# EAGLE design TinyISD1700_V2_2014-08-29sop (EAGLE 7.5.0)
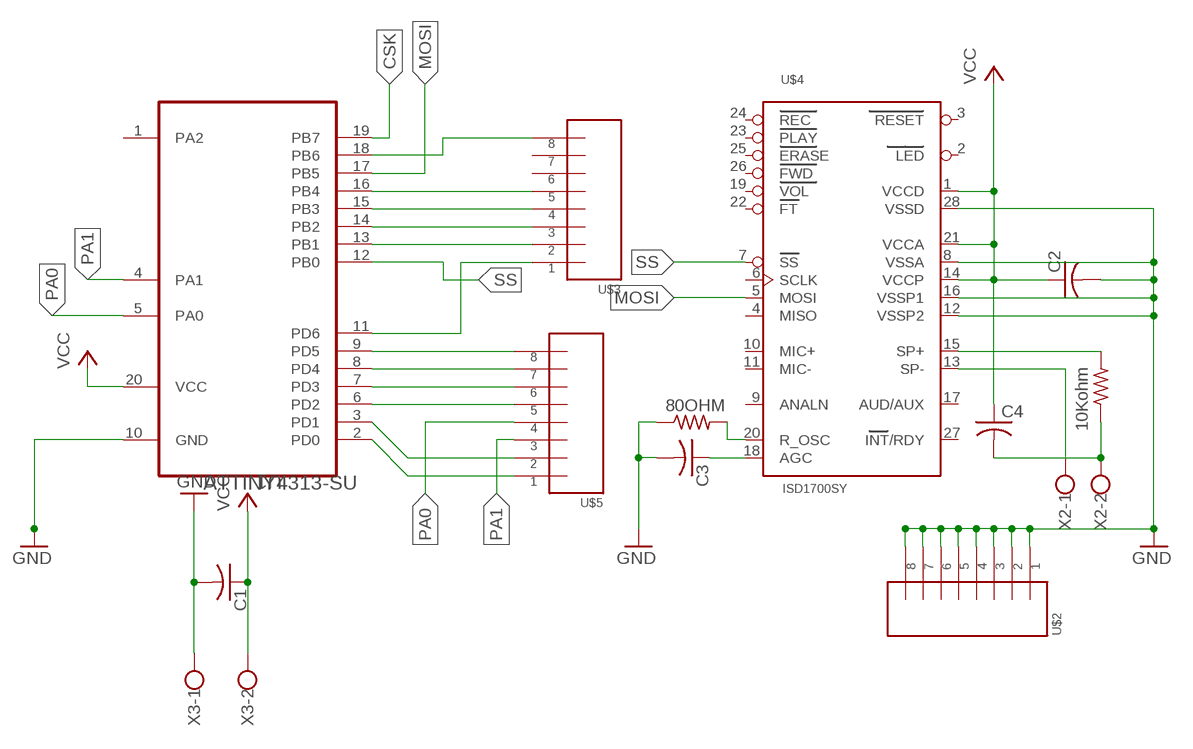
[diagram p0: schematic, sheet 1]

## Parts
80OHM  R-US_0204/2V  [0204V]
80OHM1  10Kohm  R-US_0204/2V  [0204V]
C1  C-US050-030X075  [C050-030X075]
C2  C-US050-030X075  [C050-030X075]
C3  C-US050-030X075  [C050-030X075]
C4  C-US050-030X075  [C050-030X075]
U1  ATTINY4313-SU  [SOIC127P1032X265-20N]
U$2  8PIN_HEADER  [8PIN_HEADER]
U$3  8PIN_HEADER  [8PIN_HEADER]
U$4  ISD1700SY  [SO28W]
U$5  8PIN_HEADER  [8PIN_HEADER]
X2  W237-102  [W237-102]
X3  W237-102  [W237-102]

## Nets
CSK: U1.19(PB7)
GND: 80OHM.1 C1.2 C2.2 C3.2 U1.10(GND) U$2.P$1 U$2.P$2 U$2.P$3 U$2.P$4 U$2.P$5 U$2.P$6 U$2.P$7 U$2.P$8 U$4.8(VSSA) U$4.12(VSSP2) U$4.16(VSSP1) U$4.28(VSSD) X3.1
MOSI: U1.17(PB5) U$4.5(MOSI)
N$1: 80OHM.2 U$4.20(R_OSC)
N$2: U1.13(PB1) U$3.P$2
N$3: U1.14(PB2) U$3.P$3
N$4: 80OHM1.1 C4.2 X2.2
N$5: C3.1 U$4.18(AGC)
N$6: U$4.13(SP-) X2.1
N$7: 80OHM1.2 U$4.15(SP+)
N$8: U1.15(PB3) U$3.P$4
N$9: U1.11(PD6) U$3.P$1
N$11: U1.9(PD5) U$5.P$8
N$12: U1.8(PD4) U$5.P$7
N$13: U1.7(PD3) U$5.P$6
N$14: U1.6(PD2) U$5.P$5
N$15: U1.3(PD1) U$5.P$2
N$16: U1.2(PD0) U$5.P$1
N$20: U1.16(PB4) U$3.P$5
PA0: U1.5(PA0) U$5.P$4
PA1: U1.4(PA1) U$5.P$3
Q: U1.18(PB6) U$3.P$8
SS: U1.12(PB0) U$4.7(SS)
VCC: C1.1 C2.1 C4.1 U1.20(VCC) U$4.1(VCCD) U$4.14(VCCP) U$4.21(VCCA) X3.2
Unconnected: U1.1(PA2) U$3.P$6 U$3.P$7 U$4.2(LED) U$4.3(RESET) U$4.4(MISO) U$4.6(SCLK) U$4.9(ANALN) U$4.10(MIC+) U$4.11(MIC-) U$4.17(AUD/AUX) U$4.19(VOL) U$4.22(FT) U$4.23(PLAY) U$4.24(REC) U$4.25(ERASE) U$4.26(FWD) U$4.27(INT/RDY)

## Library data of the parts
80OHM 80OHM1 = rcl:R-US_: RESISTOR, American symbol; OC_FARNELL: unknown
C1-C4 = resistor:C-US: CAPACITOR, American symbol; OC_FARNELL: unknown
U1 = Atmel_By_element14_Batch_1-00:ATTINY4313-SU: 8-bit Microcontroller with In-System Programmable Flash; MF: MICROCHIP; MPN: ATTINY4313-SU; OC_FARNELL: 1841621; OC_NEWARK: 12T1340; PACKAGE: SOIC-20; SUPPLIER: Atmel
U$2 U$3 U$5 = arduino:8PIN_HEADER; MF: RENESAS; MPN: YSDKS128E10; OC_FARNELL: 2946736
U$4 = isd-new-1:ISD1700; OC_FARNELL: unknown
X2 X3 = con-wago-500:W237-102: WAGO SCREW CLAMP; OC_FARNELL: unknown; OC_NEWARK: 70K9898

## Board
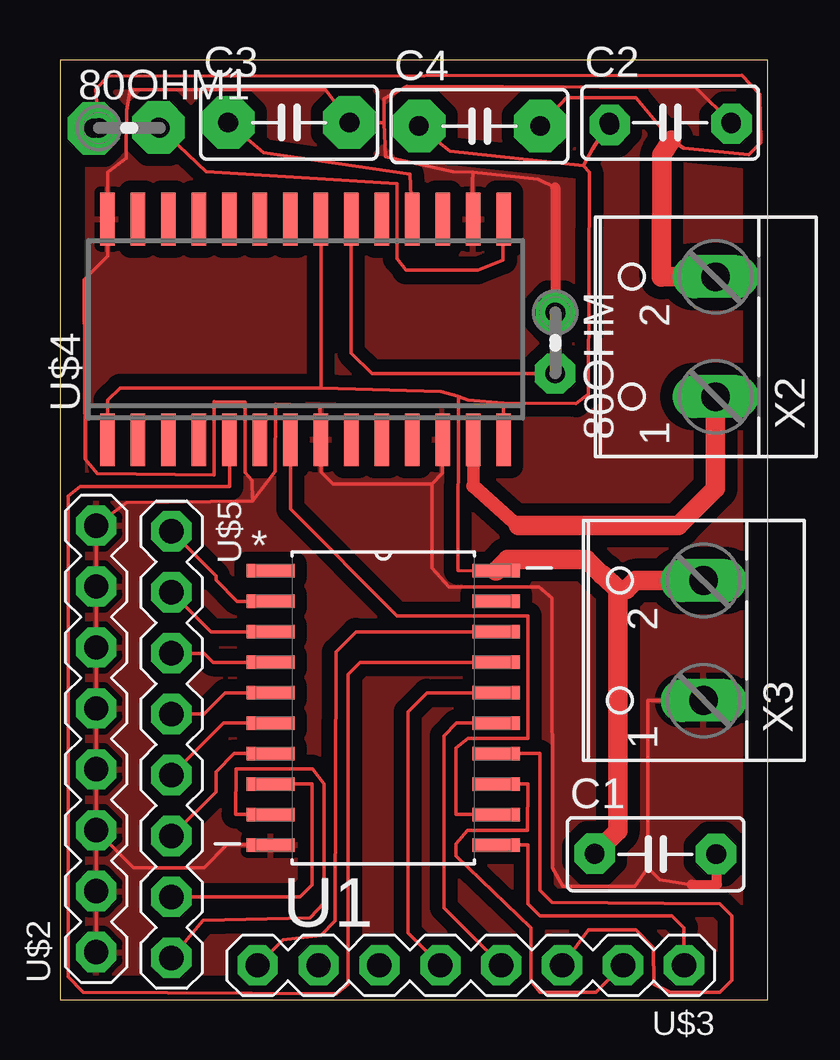
[diagram p1: board, top side]

Size 29.5 x 39.17 mm. Coordinates in mm from the lower left corner, seen from the top.
Outline: 0,0 29.5,0 29.5,39.17 0,39.17 0,0
Copper layers (1*16): Top 0.035mm / dielectric 1.5mm / Bottom 0.035mm
Design rules "default *": minimum track width 10mil, minimum drill 24mil, track to track 20mil, track to pad 20mil, pad to pad 20mil, via to via 20mil, smd to smd 8mil, copper to edge 40mil, drill to drill 8mil, minimum pad ring 10mil, minimum via ring 8mil, stop-mask expansion 4mil, vias tented up to drill 0mil, thermal gap 10mil

### Footprints (pad centres in the part's own frame; a part is rotated, then mirrored left to right if it is on the bottom)
0204V = drill 0.813 octagon: 1 -1.27,0; 2 1.27,0
C050-030X075 = drill 0.813 octagon: 1 -2.54,0; 2 2.54,0
SOIC127P1032X265-20N = smd 1.981 x 0.559: 1 -4.699,5.715; 2 -4.699,4.445; 3 -4.699,3.175; 4 -4.699,1.905; 5 -4.699,0.635; 6 -4.699,-0.635; 7 -4.699,-1.905; 8 -4.699,-3.175; 9 -4.699,-4.445; 10 -4.699,-5.715; 11 4.699,-5.715; 12 4.699,-4.445; 13 4.699,-3.175; 14 4.699,-1.905; 15 4.699,-0.635; 16 4.699,0.635; 17 4.699,1.905; 18 4.699,3.175; 19 4.699,4.445; 20 4.699,5.715
8PIN_HEADER = drill 1.016 pad 1.676 octagon: P$1 0,0; P$2 2.54,0; P$3 5.08,0; P$4 7.62,0; P$5 10.16,0; P$6 12.7,0; P$7 15.24,0; P$8 17.78,0
SO28W = smd 0.6 x 2.2: 1 -8.255,-4.6; 2 -6.985,-4.6; 3 -5.715,-4.6; 4 -4.445,-4.6; 5 -3.175,-4.6; 6 -1.905,-4.6; 7 -0.635,-4.6; 8 0.635,-4.6; 9 1.905,-4.6; 10 3.175,-4.6; 11 4.445,-4.6; 12 5.715,-4.6; 13 6.985,-4.6; 14 8.255,-4.6; 15 8.255,4.6; 16 6.985,4.6; 17 5.715,4.6; 18 4.445,4.6; 19 3.175,4.6; 20 1.905,4.6; 21 0.635,4.6; 22 -0.635,4.6; 23 -1.905,4.6; 24 -3.175,4.6; 25 -4.445,4.6; 26 -5.715,4.6; 27 -6.985,4.6; 28 -8.255,4.6
W237-102 = drill 1.194 long: 1 -2.5,-1.27; 2 2.5,-1.27

### Placement (x,y rotation side)
80OHM  20.65,27.37 270 top
80OHM1  2.89,36.34 0 top
C1  24.83,6.06 0 top
C2  25.44,36.56 0 top
C3  9.55,36.56 0 top
C4  17.49,36.41 0 top
U1  13.48,12.16 0 top
U$2  1.51,1.98 90 top
U$3  26.02,1.43 180 top
U$4  10.24,27.94 0 top
U$5  4.65,19.52 270 top
X2  26.06,27.63 90 top
X3  25.56,14.97 90 top

### Tracks (layer width: path | path; a pad name or v marks a point on that pad's centre or on a via)
GND
  Top 0.152: 8.03,20.78 8,21.64 7.71,21.96 7.72,24.91 6.43,24.93 6.42,21.87 1.56,21.93 1.06,22.54 1,30.02 1.99,31 U$4.28 1.99,34.48 2.75,35.07 2.77,37.07 2.92,37.94 11.07,37.94 C3.2 13.51,36.55 | 17.22,34.5 19.92,34.2 20.65,33.85 | 17.22,34.5 16.39,34.52 14.49,34.94 13.57,35.14 13.51,36.55 | 15.5,21.5 11.38,21.5 10.88,22 U$4.8 10.85,24.77 8.99,24.83 8.98,22.01 8.03,20.78 | U$2.P$3 3.07,5.5 6,5.5 6.95,6.45 U1.10 | 24.5,5.5 24.5,12.47 X3.1 | 24.5,5.5 25,5 26.33,4.79 | 15.5,21.5 15.5,18 16.23,17.21 19.97,17.21 20.5,16.74 20.53,5.5 20.97,4.72 23.97,4.72 24.5,5.5 | 13.51,36.55 13.52,37.55 14.48,38.08 26.52,38.01 C2.2 | 15.5,21.5 15.96,21.95 U$4.12 | 17.22,34.5 17.2,34.1 17.21,33.84 17.21,33.8 U$4.16 | U$2.P$3 U$2.P$2 U$2.P$1 | U$2.P$3 U$2.P$4 U$2.P$5 U$2.P$6 U$2.P$7 U$2.P$8 2.78,20.73 8.03,20.78
  Top 0.406: 26.33,4.79 27.39,4.79 C1.2 | 20.65,33.85 80OHM.1
  pour Top: 0,39 29.5,39 29.5,0 0,0 0.5,0.5
MOSI
  Top 0.152: U1.17 12.5,14.06 12,13.56 12.02,0.63 11.54,0.25 0.96,0.3 0.34,0.96 0.34,21 0.84,21.38 7.07,21.38 U$4.5
N$1
  Top 0.152: 80OHM.2 13,26.1 12.14,26.95 U$4.20
N$2
  Top 0.152: U$3.P$2 22.35,0.3 20,0.3 19.64,0.78 19.64,2.99 16.5,6 16.5,6.5 16.99,7.05 19.49,7.05 19.5,8.98 U1.13
N$3
  Top 0.152: U$3.P$3 22.02,2.91 24.01,2.91 24.74,2.16 24.76,0.65 25.45,0.3 27.5,0.3 28,0.8 28,3.5 27.5,4 20.52,4.06 20.02,4.56 20,10.26 U1.14
N$4
  Top 0.152: 80OHM1.1 1.49,37.94 2,38.5 28.42,38.54 29.17,37.74 29.22,35.73 28.72,35.23 26,35.5 25.49,35.83 24,37.59 21.12,37.59 C4.2
  Top 0.813: X2.2 25.1,30.13 25.08,30.11 25.09,35.07 25.1,35.09 25.1,35.22 25.49,35.83
N$5
  Top 0.152: C3.1 8.49,35.3 14.59,34.41 U$4.18
N$6
  Top 0.513: 17.24,21.41 U$4.13
  Top 0.6: 19.11,19.72 17.24,21.41
  Top 0.613: 19.12,19.76 19.11,19.72
  Top 0.813: X2.1 27.33,21.31 25.79,19.76 19.12,19.76
N$7
  Top 0.152: 80OHM1.2 6.1,34.52 14.05,34.01 14.05,30.88 14.42,30.41 17.42,30.41 18.48,30.82 U$4.15
N$8
  Top 0.152: U$3.P$4 16,3.83 16,11 16.52,11.53 U1.15
N$9
  Top 0.152: U$3.P$1 26.02,3 25.52,3.5 20,3.5 19.5,4 19.5,6.45 U1.11
N$10  (via drill 0.8 pad 2.18)
  other vias: 1.41,36.32
N$11
  Top 0.152: U$5.P$8 5.97,3.31 10.43,3.4 11,4.03 11,9 10.52,9.63 7.34,9.63 7.32,7.71 U1.9
N$12
  Top 0.152: U$5.P$7 10,4.28 10.5,4.78 10.5,8.98 U1.8
N$13
  Top 0.152: U$5.P$6 6.5,8.67 6.5,9.5 7.25,10.26 U1.7
N$14
  Top 0.152: U$5.P$5 6.82,11.53 U1.6
N$15
  Top 0.152: U$5.P$2 6.29,15.34 U1.3
N$16
  Top 0.152: U$5.P$1 6.5,17.67 6.5,17.5 7.39,16.61 U1.2
N$17  (via drill 0.8 pad 2.18)
  other vias: 4.11,36.35
N$18  (via drill 0.8 pad 2.18)
  other vias: 7.02,36.56
N$19  (via drill 0.8 pad 2.18)
  other vias: 12.06,36.56
N$20
  Top 0.152: U$3.P$5 14.5,2.79 14.5,12 15.29,12.79 U1.16
N$21  (via drill 0.8 pad 2.18)
  other vias: 14.97,36.42
N$22  (via drill 0.8 pad 2.18)
  other vias: 20.03,36.41
N$23  (via drill 0.8 pad 1.68)
  other vias: 22.93,36.46
N$24  (via drill 0.8 pad 1.68)
  other vias: 28,36.51
N$25  (via drill 0.8 pad 1.68)
  other vias: 20.68,28.63
N$26  (via drill 0.8 pad 1.68)
  other vias: 20.64,26.09
N$27  (via drill 0.8 pad 1.68)
  other vias: 22.29,6.08
N$28  (via drill 0.8 pad 1.68)
  other vias: 27.35,6.06
PA0
  Top 0.152: U$5.P$4 6,11.9 6.89,12.79 U1.5
PA1
  Top 0.152: U$5.P$3 6,14.44 6.38,14.06 U1.4
Q
  Top 0.152: U$3.P$8 9.31,2.5 10.9,2.69 11.48,3.28 11.5,14.5 12.34,15.34 U1.18
SS
  Top 0.152: U1.12 16.5,7.71 16.5,10.5 17.01,10.89 19.51,10.89 19.5,16 14.06,16 9.61,20.45 U$4.7
VCC
  Top 0.152: 21.82,34.77 22.07,34.48 22.04,25.25 21.51,24.85 18.49,24.88 | 18.49,24.88 U$4.14 | 10.88,25.5 2.5,25.5 1.99,24.98 U$4.1 | U1.20 16.59,17.89 16.61,25.13 | 16.61,25.13 16.56,25.16 15.89,25.35 10.88,25.5 | 21.82,34.77 16.26,35.36 C4.1 | 21.82,34.77 22.19,35.46 C2.1 | 10.88,25.5 U$4.21 | 16.61,25.13 17,25 18.49,24.88
  Top 0.813: X3.2 23.99,17.47 23.62,17.1 23.25,17.1 | 23.25,17.1 22.64,17.71 22.59,17.71 21.96,18.35 18.65,18.35 U1.20 | 23.25,17.1 23.25,7.03 C1.1